# EAGLE design single_LED_driver (EAGLE 6.4)
PROJECT: RGB_driver
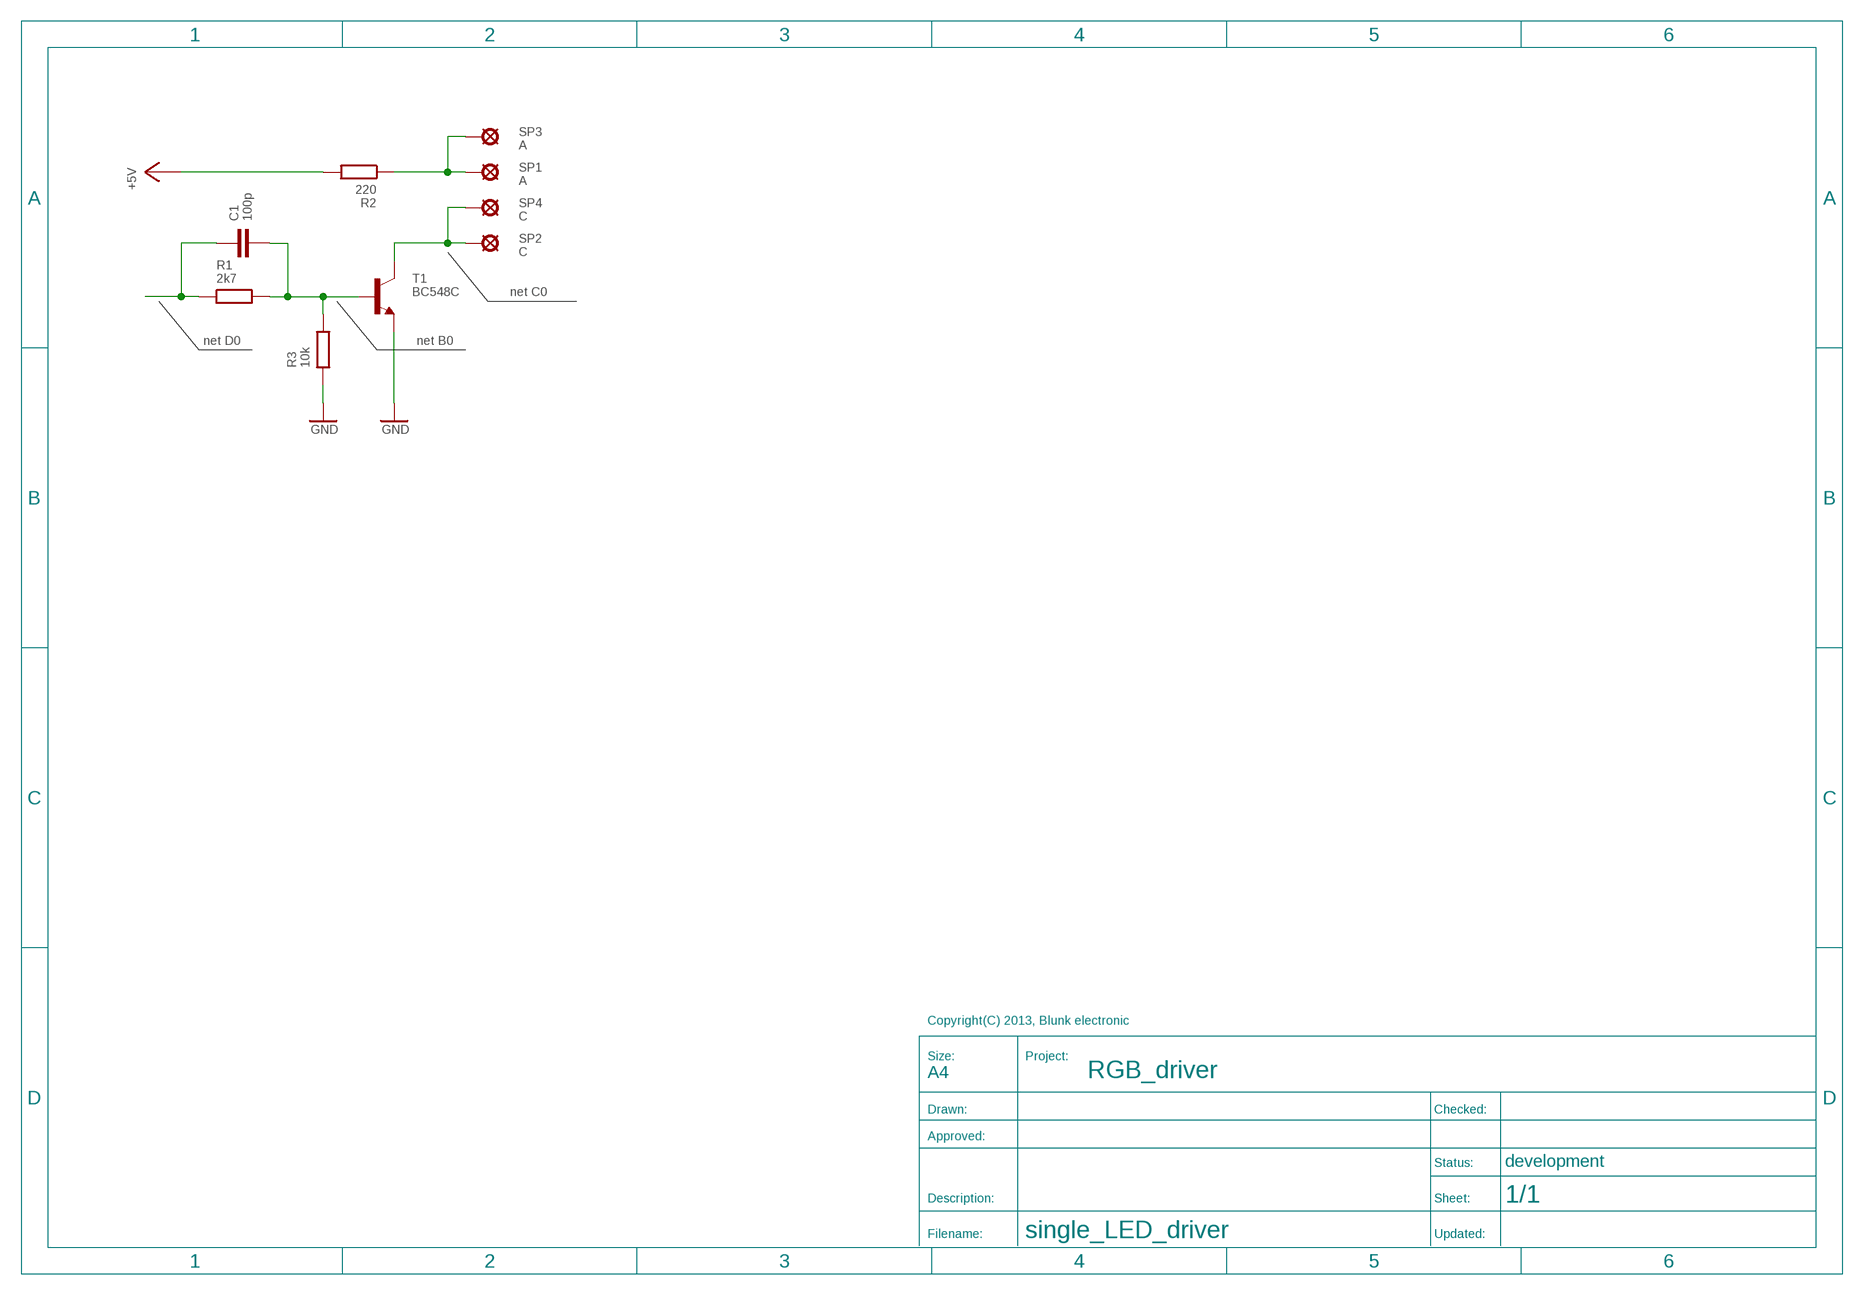
[diagram p0: schematic, sheet 1]
U$1 (A4_LANDSCAPE_DEVELOPMENT): COMMISSIONED: 2013-03-26

## Parts
C1  100p  C_EU_S_0805  [S_0805]
R1  2k7  R_EU_S_0805  [S_0805]
R2  220  R_EU_S_0805  [S_0805]
R3  10k  R_EU_S_0805  [S_0805]
SP1  A  TEST_POINT-T-SMALL  [T_TEST_POINT_SMALL]
SP2  C  TEST_POINT-T-SMALL  [T_TEST_POINT_SMALL]
SP3  A  TEST_POINT-T-SMALL  [T_TEST_POINT_SMALL]
SP4  C  TEST_POINT-T-SMALL  [T_TEST_POINT_SMALL]
T1  BC548C  NPN  [T_TO-92-CBE]

## Nets
+5V [PWR]: R2.2
A0: R2.1 SP1.1(MP) SP3.1(MP)
B0: C1.2 R1.2 R3.2 T1.B
C0: SP2.1(MP) SP4.1(MP) T1.C
D0: C1.1 R1.1
GND [PWR]: R3.1 T1.E

## Notes on the sheet
- net C0
- net D0 | net B0

## Library data of the parts
C1 = be_rcl:C_EU: Capacitor Device EU drawn: Mario Blunk / Blunk electronic
R1-R3 = be_rcl:R_EU: Resistor Device EU drawn: Mario Blunk / Blunk electronic
SP1-SP4 = be_con_jump:TEST_POINT: test point device drawn: Mario Blunk / Blunk electronic; COMMISSIONED: 2013-03-28
T1 = be_transistoren:NPN: NPN Transistor device drawn: Mario Blunk / Blunk electronic; COMMISSIONED: 2013-05-03

## Net classes
1 PWR: width 0.254 mm

## Board
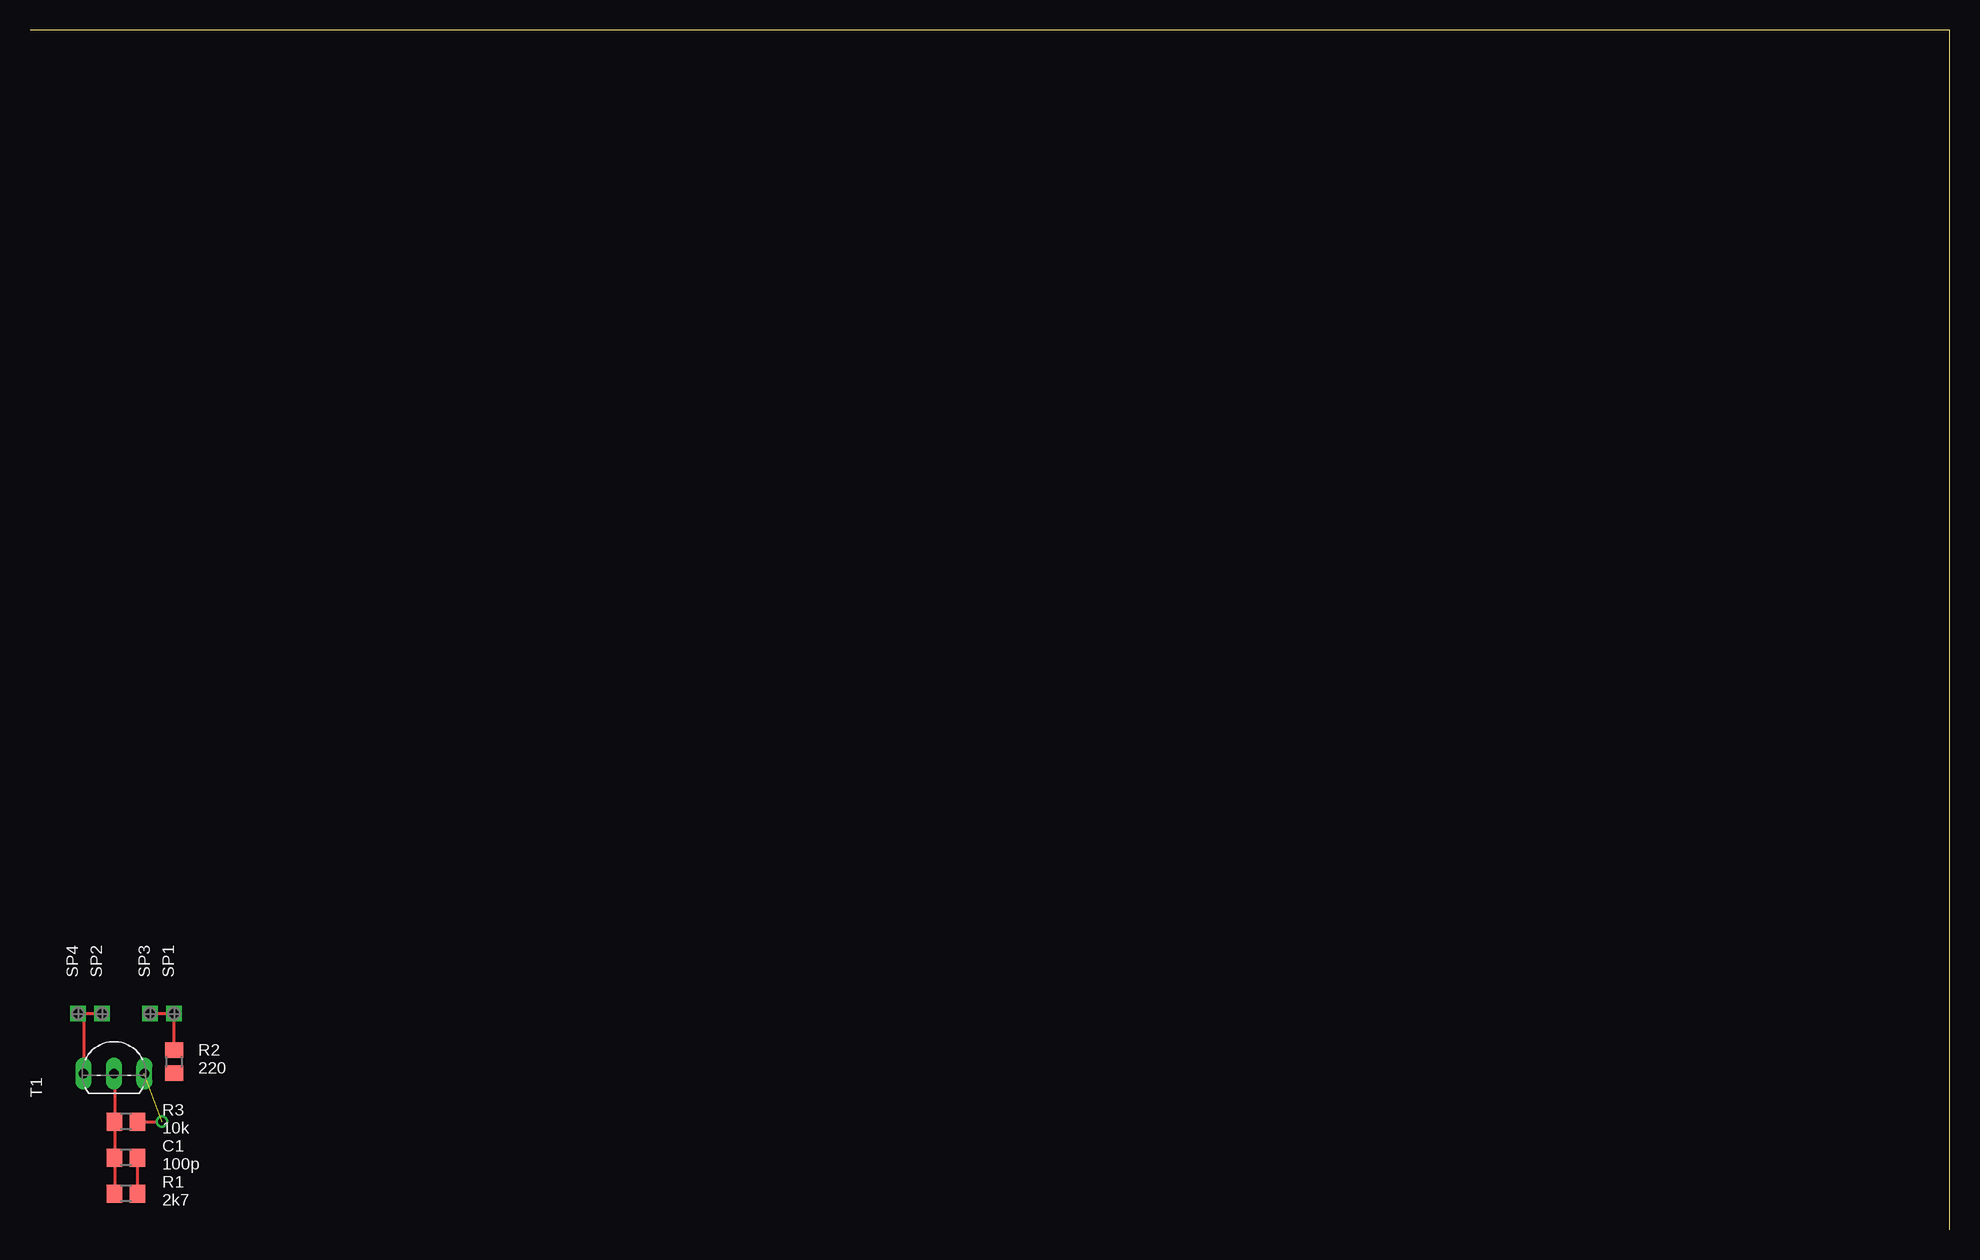
[diagram p1: board, top side]

Size 160 x 100 mm. Coordinates in mm from the lower left corner, seen from the top.
Outline: 160,0 160,100 0,100
Copper layers (1*16): Top 0.035mm / dielectric 1.5mm / Bottom 0.035mm
Design rules "default": minimum track width 10mil, minimum drill 0.6mm, track to track 8mil, track to pad 8mil, pad to pad 8mil, via to via 8mil, smd to smd 8mil, copper to edge 40mil, drill to drill 8mil, minimum pad ring 10mil, minimum via ring 8mil, stop-mask expansion 4mil, vias tented up to drill 0mil, thermal gap 10mil

### Footprints (pad centres in the part's own frame; a part is rotated, then mirrored left to right if it is on the bottom)
S_0805 = smd 1.3 x 1.5: 1 -0.95,0; 2 0.95,0
T_TEST_POINT_SMALL = drill 0.8 square: 1 0,0
T_TO-92-CBE = drill 0.813 long: B 0,0; C -2.54,0; E 2.54,0

### Placement (x,y rotation side)
C1  8,6 180 top
R1  8,3 180 top
R2  12,14 270 top
R3  8,9 180 top
SP1  12,18 0 top
SP2  6,18 0 top
SP3  10,18 0 top
SP4  4,18 0 top
T1  7,13 0 top

### Tracks (layer width: path | path; a pad name or v marks a point on that pad's centre or on a via)
A0
  Top 0.254: R2.1 SP1.1 SP3.1
B0
  Top 0.254: T1.B 7.05,13 R3.2 C1.2 R1.2
C0
  Top 0.254: SP2.1 SP4.1 4.46,18 T1.C
D0
  Top 0.254: C1.1 R1.1
GND  (via drill 0.6)  (1 unrouted)
  Top 0.254: R3.1 v11,9